# Altium schematic sheet SimPL_IMU_v1_1 _NOV23.SchDoc
size 299 x 236 mm
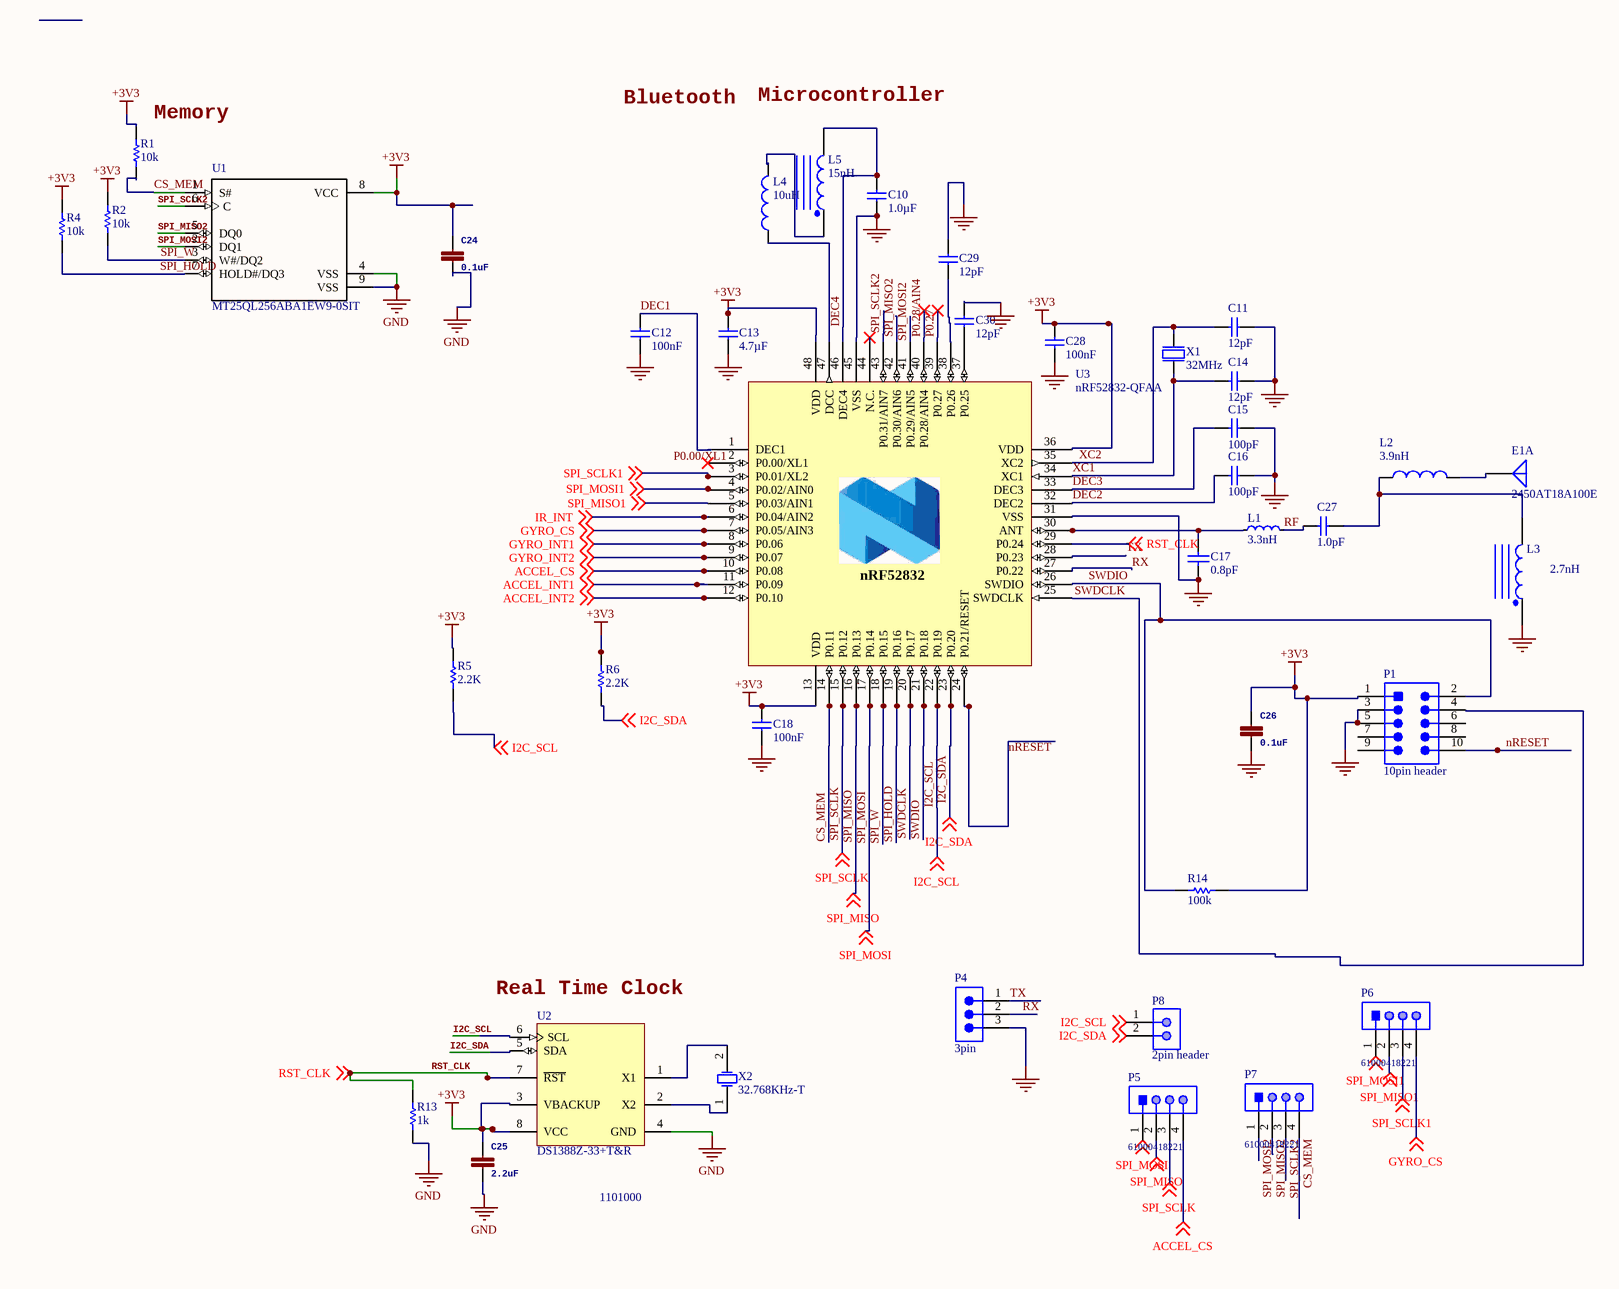
[diagram p0: SimPL_IMU_v1_1 _NOV23.SchDoc]

## Parts
C10  1.0µF  [CAPC1005X04L]
C11  12pF  [CAPC0603X03L]
C12  100nF  [CAPC0603X03L]
C13  4.7µF  [CAPC1608X06L]
C14  12pF  [CAPC0603X03L]
C15  100pF  [CAPC0603X03L]
C16  100pF  [CAPC0603X03L]
C17  0.8pF  [CAPC1006X50X20ML10T10]
C18  100nF  [CAPC0603X03L]
C24  0.1uF  [0402]
C25  2.2uF  [0402]
C26  0.1uF  [0402]
C27  1.0pF  [CAPC0603X03L]
C28  100nF  [CAPC0603X03L]
C29  12pF  [CAPC0603X03L]
C30  12pF  [CAPC0603X03L]
E1  2450AT18A100E  [JT-2450AT18A100-2_V]  (part A of 2)
L1  3.3nH  [INDC0603X03L]
L2  3.9nH  [*INDC1006X60N]
L3  2.7nH  [INDC1005X55X25LL05T10_A]
L4  10uH  [MURA-IND0805_L]
L5  15nH  [INDC1005X55X25ML05T10_A]
P1  10pin header  [SMTC-FTSH-105-01-L-DV_V]
P4  3pin  [SMTC-TSW-103-07-X-S]
P5  61000418221  [61000418221]
P6  61000418221  [61000418221]
P7  61000418221  [61000418221]
P8  2pin header  [AMPH-68000-102HLF_V]
R1  10k  [RESC1005X40X25NL05T05]
R2  10k  [RESC1005X40X25NL05T05]
R4  10k  [RESC1005X40X25NL05T05]
R5  2.2K  [RESC1005X40X25ML10T10]
R6  2.2K  [RESC1005X40X25ML10T10]
R13  1k  [RESC1005X40X25NL05T05]
R14  100k  [RESC1005X40X25ML05T05]
U1  MT25QL256ABA1EW9-0SIT  [*SON127P600X800X80-9N]
U2  DS1388Z-33+T&R  [S8+4_M]
U3  nRF52832-QFAA  [QFN40P600X600X90-48N]
X1  32MHz  [BT-XTAL_2016]
X2  32.768KHz-T  [ABRA-ABS07-2_V]

## Nets
+3V3: C13.1 C18.1 C24.1 C25.1 C26.1 C28.1 P1.1 R1.2 R2.2 R4.2 R5.2 R6.2 R14.2 U1.8(VCC) U2.3(VBACKUP) U2.8(VCC) U3.13(VDD) U3.36(VDD) U3.48(VDD)
GND: C10.1 C11.1 C12.2 C13.2 C14.1 C15.2 C16.1 C17.1 C18.2 C24.2 C25.2 C26.2 C28.2 C29.1 C30.1 L3.1 P1.3 P1.5 P4.3 R13.1 U1.4(VSS) U1.9(VSS) U2.4(GND) U3.31(VSS) U3.45(VSS) U3.49(GND) X1.2(GND) X1.4(GND)
ACCEL_CS: P5.4 U3.10(P0.08) ; off-sheet ACCEL_CS
ACCEL_INT1: U3.11(P0.09) ; off-sheet ACCEL_INT1
ACCEL_INT2: U3.12(P0.10) ; off-sheet ACCEL_INT2
CS_MEM: P7.4 R1.1 U1.1(S#) U3.14(P0.11)
DEC1: C12.1 U3.1(DEC1)
DEC2: C16.2 U3.32(DEC2)
DEC3: C15.1 U3.33(DEC3)
DEC4: C10.2 L5.2 U3.46(DEC4)
GYRO_CS: P6.4 U3.7(P0.05/AIN3) ; off-sheet GYRO_CS
GYRO_INT1: U3.8(P0.06) ; off-sheet GYRO_INT1
GYRO_INT2: U3.9(P0.07) ; off-sheet GYRO_INT2
I2C_SCL: P8.1 R5.1 U2.6(SCL) U3.22(P0.19) ; off-sheet I2C_SCL
I2C_SDA: P8.2 R6.1 U2.5(SDA) U3.23(P0.20) ; off-sheet I2C_SDA
IR_INT: U3.6(P0.04/AIN2) ; off-sheet IR_INT
nRESET: P1.10 U3.24(P0.21/RESET)
P0.27: U3.39(P0.27)
P0.28/AIN4: U3.40(P0.28/AIN4)
RF: C27.2 L1.2
RST_CLK: R13.2 U2.7(~{RST}) U3.29(P0.24) ; off-sheet RST_CLK
RX: P4.2 U3.27(P0.22)
SPI_HOLD: R4.1 U1.7(HOLD#/DQ3) U3.19(P0.16)
SPI_MISO: P5.2 U3.16(P0.13) ; off-sheet SPI_MISO
SPI_MISO1: P6.2 U3.5(P0.03/AIN1) ; off-sheet SPI_MISO1
SPI_MISO2: P7.2 U1.5(DQ0) U3.42(P0.30/AIN6)
SPI_MOSI: P5.1 U3.17(P0.14) ; off-sheet SPI_MOSI
SPI_MOSI1: P6.1 U3.4(P0.02/AIN0) ; off-sheet SPI_MOSI1
SPI_MOSI2: P7.1 U1.2(DQ1) U3.41(P0.29/AIN5)
SPI_SCLK: P5.3 U3.15(P0.12) ; off-sheet SPI_SCLK
SPI_SCLK1: P6.3 U3.3(P0.01/XL2) ; off-sheet SPI_SCLK1
SPI_SCLK2: P7.3 U1.6(C) U3.43(P0.31/AIN7)
SPI_W: R2.1 U1.3(W#/DQ2) U3.18(P0.15)
SWDCLK: P1.4 U3.20(P0.17) U3.25(SWDCLK)
SWDIO: P1.2 R14.1 U3.21(P0.18) U3.26(SWDIO)
TX: P4.1 U3.28(P0.23)
XC1: C14.2 U3.34(XC1) X1.1(inp)
XC2: C11.2 U3.35(XC2) X1.3(out)
NetC17_2: C17.2 L1.1 U3.30(ANT)
NetC27_1: C27.1 L2.1 L3.2
NetC29_2: C29.2 U3.38(P0.26)
NetC30_2: C30.2 U3.37(P0.25)
NetE1_1: E1.1(FP) L2.2
NetL4_1: L4.1 U3.47(DCC)
NetL4_2: L4.2 L5.1
NetU2_1: U2.1(X1) X2.2(X2)
NetU2_2: U2.2(X2) X2.1(X2)

Not connected (* = marked no-connect by the designer): P1 6 7 8 9; U3 2(P0.00/XL1)* 44(N.C.)*

## Notes on the sheet
- (near R1) Memory
- Bluetooth
- Microcontroller
- (near U2) Real Time Clock
- 1101000
- Labels drawn without touching a wire or pin: P0.00/XL1
- (in symbol nRF52832_QFAA) nRF52832

## Library data of the parts
C10 = C0402-1µ0: Capacitor, X5R, ±5%; Note: 6.3V; Artikkelnr Noca: 20039235; Artikkelnr Simpro: N.A.; Part Number: C0402-1µ0; Manufacturer: *; Manufacturer Part Number: *; Datasheet: *; LatestRevisionDate: 2009-11-23; Pin Count: 2; Publisher: Nordic Semiconductor; Published: 2009-05-08; Value: 1.0µF; Supplier: *; Supplier part number: *; 2nd source Supplier: *; 2nd source part number: *; Footprint Doc: 0402
C11 C14 C29 C30 = C0201-12p: Capacitor, NP0, ±2%; Note: 50V; Artikkelnr Noca: N.A.; Part Number: C0201-12p; Manufacturer: *; Manufacturer Part Number: *; Datasheet: *; LatestRevisionDate: 2014-11-13; Pin Count: 2; Publisher: Nordic Semiconductor; Published: 2014-11-13; Value: 12pF; Supplier: *; Supplier part number: *; 2nd source Supplier: *; 2nd source part number: *; Footprint Doc: 0201; Artikkelnr Simpro: N.A.
C12 C18 C28 = C0201-100n: Capacitor, X7R, ±10%; Note: 16V; Artikkelnr Noca: N.A.; Part Number: C0201-100n; Manufacturer: *; Manufacturer Part Number: *; Datasheet: *; LatestRevisionDate: 2014-11-13; Pin Count: 2; Publisher: Nordic Semiconductor; Published: 2014-11-13; Value: 100nF; Supplier: *; Supplier part number: *; 2nd source Supplier: *; 2nd source part number: *; Footprint Doc: 0201; Artikkelnr Simpro: N.A.
C13 = C0603-4µ7: Capacitor, X5R, ±10%; Note: 6.3V; Artikkelnr Noca: 20069060; Artikkelnr Simpro: N.A.; Part Number: C0603-4µ7; Manufacturer: *; Manufacturer Part Number: *; Datasheet: *; LatestRevisionDate: 2009-11-23; Pin Count: 2; Publisher: Nordic Semiconductor; Published: 2009-05-08; Value: 4.7µF; Supplier: *; Supplier part number: *; 2nd source Supplier: *; 2nd source part number: *; Footprint Doc: 0603
C15 C16 = C0201-100p: Capacitor, NP0, ±5%; Note: Chip Cap 1%; Artikkelnr Noca: N.A.; Part Number: C0201-100p; Manufacturer: *; Manufacturer Part Number: *; Datasheet: *; LatestRevisionDate: 2014-11-13; Pin Count: 2; Publisher: Nordic Semiconductor; Published: 2014-11-13; Value: 100pF; Supplier: *; Supplier part number: *; 2nd source Supplier: *; 2nd source part number: *; Footprint Doc: 0201; Artikkelnr Simpro: N.A.
C17 = CMP-2008-04732-1: Part Number: 04023J0R8PBSTR; Manufacturer: AVX Interconnect / Elco
C24 C26 = 0.1UF-0402-16V-10%: 0.1ÂµF ceramic capacitors    A capacitor is a passive two-terminal electrical component used to store electrical energy temporarily in an electric field.; GateName_1: G$1; SymbolName_1: CAP; PROD_ID: CAP-12416; DeviceName: -0402-16V-10%; LibraryName: SparkFun-Capacitors; DeviceSetName: 0.1UF
C25 = 0.1UF-0402-16V-10%: 0.1ÂµF ceramic capacitors    A capacitor is a passive two-terminal electrical component used to store electrical energy temporarily in an electric field.; GateName_1: G$1; SymbolName_1: CAP; DeviceSetName: 0.1UF; PROD_ID: CAP-12416; DeviceName: -0402-16V-10%; LibraryName: SparkFun-Capacitors
C27 = C0201-1.0p: Capacitor, NP0, ±5%; Note: Chip Cap 1%; Artikkelnr Noca: N.A.; Part Number: C0201-1.0p; Manufacturer: *; Manufacturer Part Number: *; Datasheet: *; LatestRevisionDate: 2014-11-13; Pin Count: 2; Publisher: Nordic Semiconductor; Published: 2014-11-13; Value: 1.0pF; Supplier: *; Supplier part number: *; 2nd source Supplier: *; 2nd source part number: *; Footprint Doc: 0201; Artikkelnr Simpro: N.A.
E1 = CMP-2000-05167-1: Ceramic Antenna, 2.45 GHZ, 2 W, -40 to 125 degC, 2-Pin SMD, RoHS, Tape and Reel; Manufacturer: Johanson Technology; Maximum Frequency: 2500MHz; Typical Antenna Gain: 0.5dB; Minimum Frequency: 2400MHz; Manufacturer URL: https://www.johansontechnology.com/; Type: Ceramic; Datasheet Version: Rev. 1.3, 07/2014; Category: Antenna; Package: 2Case18-4; Datasheet URL: http://www.johansontechnology.com/datasheets/antennas/2450AT18A100.pdf
L1 = L0201-3n3: High frequency chip inductor ±5%; Artikkelnr Noca: N.A.; Part Number: L0201-3n3; Manufacturer: *; Manufacturer Part Number: *; Datasheet: *; LatestRevisionDate: 2013-04-10; Pin Count: 2; Publisher: Nordic Semiconductor; Published: 2013-04-10; Value: 3.3nH; Note: High frequency chip inductor ±5%; Supplier: *; Supplier part number: *; 2nd source Supplier: *; 2nd source part number: *; Footprint Doc: 0201; Artikkelnr Simpro: N.A.
L2 = MHQ1005P3N9CT000: Inductor, 3.9nh, 0.2nh, 0.9a, 0402; MF: TDK; SnapEDA_Link: https://www.snapeda.com/parts/MHQ1005P3N9CT000/TDK/view-part/?ref=snap; MP: MHQ1005P3N9CT000; Availability: Unavailable; Package: 1006 TDK; Price: None; Value: *
L3 = CMP-2000-06580-1: Chip Inductor, 2.7 nH, +/- 0.3 nH, 300 mA, -55 to 125 degC, 0402 (1005 Metric), RoHS, Tape and Reel; Manufacturer: Murata; Type: Multilayer; Frequency - Self Resonant: 6GHz; Shielding: Unshielded; Online Catalog: LQG15HxSeries; Other Names: 490-2615-2; Catalog Drawings: LQG15HSSeriesTopLQG15HSSeriesEnd; Q @ Freq: 8@100MHz; DC Resistance (DCR): 150mOhmMax; Frequency - Test: 100MHz; Product Training Modules: InductorProducts; Current Rating: 300mA; Material - Core: Air; Tolerance: ±0.3nH; Package Description: 2-Pin Surface Mount Device, Body 1 x 0.5 mm; Inductance: 2.7nH; Mounting Technology: SurfaceMount; Height - Seated (Max): 0.022"(0.55mm); Category: Inductors,Coils,Chokes; Package / Case: 0402(1005Metric); Package Reference: 0402; Standard Package: 10,000; Operating Temperature: -55°C~125°C; Mounting Type: SurfaceMount; Packaging: Tape&Reel(TR); Series: LQG15HS; Datasheet URL: http://search.murata.co.jp/Ceramy/image/img/PDF/ENG/L0075S0083LQG15HS.pdf; Manufacturer URL: http://www.murata.com/; Family: FixedInductors; Size / Dimension: 0.039"Lx0.020"W(1.00mmx0.50mm); Datasheet Version: 09/2010
L4 = CMP-2000-06587-1: Fixed Inductor, 10 uH, +/-20%, -55 to 125 degC, 2-Pin SMD (0805), RoHS, Tape and Reel; Manufacturer: Murata; Tolerance (%): 20%; DC Resistance: 0.6; Inductance-Nom: 10H; Rated Current-Max: 100mA; Package Reference: IND0805; Case Size/Dimension: 0805; Manufacturer URL: http://www.murata.com/; Package Description: 2-Pin Surface Mount Device, Body 2 x 1.25 mm; Datasheet URL: http://psearch.en.murata.com/inductor/product/LQM21FN100M70%23.pdf; Mounting Technology: SurfaceMount; Datasheet Version: 05/2016
L5 = CMP-2100-03652-1: Chip Inductor, 15 nH, +/- 5%, 100 MHz, -55 to 125 degC, 0402 (1005 Metric), RoHS, Paper Tape; Manufacturer: Murata; DC Current: 300mA; Q Factor: 8; Self Resonant Frequency: 2.5GHz; DC Resistance (DCR): 320mOhm; Test Frequency: 100MHz; Shielding: Unshielded; Core Material: Air; Lead Free: LeadFree; Package Quantity: 10000; Package Description: 2-Pin Surface Mount Device, Body 1 x 0.5 mm; Case Code (Imperial): 0402; Termination: SMD/SMT; Datasheet URL: http://psearch.en.murata.com/inductor/product/LQG15HS15NJ02_.pdf; Case Code (Metric): 1005; Tolerance: 5%; Min Operating Temperature: -55degC; Radiation Hardening: No; Width: 0.02inch; Current Rating: 300mA; Packaging: TapeandReel; Height: 0.5mm; Manufacturer URL: http://www.murata.com/; Case/Package: 0402; Max DC Current: 300mA; Height - Seated (Max): 0.022inch; Package Reference: 0402; Length: 1mm; Max Operating Temperature: 125degC; Military Standard: Not; Datasheet Version: 42675.0; Depth: 0.55mm; Inductance: 15nh; RoHSCompliant: true
P1 = CMP-2000-05354-1: Male Header, Pitch 1.27 mm, 2 x 5 Position, Height 5.96 mm, -55 to 125 degC, RoHS, Bulk; Manufacturer: Samtec; Connector Type: Header,Unshrouded; Pitch: 0.050"(1.27mm); Mating Products: FLE-105-01-G-DV-TR-ND-CONNSKT1.27MM10POSDUALSMDCLP-105-02-G-D-P-TR-ND-CONNRCPT10POSDUAL.05"SMDSFMC-105-L2-S-D-TR-ND-CONN.05"SURFACE10POSSMTSFMH-105-02-L-D-TR-ND-CONNRECEPT10POS.50"SMTFLE-105-01-G-DV-A-ND-CONNSKT1.27MM10POSDUALSMDCLP-105-02-G-D-BE-ND-CONNRCPT10POSDUAL.05"SMDFLE-105-01-G-DV-A-P-ND-CONNSKT1.27MM10POSDUALSMDSAM1153-05-ND-CONNRCPT10POSDUAL.05"SMDSAM1155-05-ND-CONNRCPT10POSDUAL.05"SMDSAM1154-05-ND-CONNRCPT10POSDUAL.05"SMDSFMH-105-02-L-D-LC-ND-CONNRECEPT10POS.50"SMTSAM1226-05-ND-CONNRCPT.05"10POSDUALSMD; Catalog Drawings: FTSHSeriesFTSHSeriesSMTSide; Other Names: SAM1161-05; EDA / CAD Models: DownloadfromAcceleratedDesigns; Number of Positions Loaded: All; Number of Positions: 10; Featured Product: Board-To-BoardInterconnectSystems; Online Catalog: FTSHSeries; Product Training Modules: Board-to-BoardConnectors; Category: Connectors,Interconnects; Number of Rows: 2; Contact Finish: Gold; Termination: Solder; Mounting Type: SurfaceMount; Series: FTSH; Contact Mating Length: 0.120"(3.05mm); Row Spacing: 0.050"(1.27mm); Datasheet URL: https://datasheet.ciiva.com/30493/0900766b80adfe36-30493006.pdf; Contact Finish Thickness: 10µin(0.25µm); Features: -; Standard Package: 1; Packaging: Bulk; Datasheet Version: Feb-08; Manufacturer URL: http://www.samtec.com/; Fastening Type: -; Family: RectangularConnectors-Headers,MalePins; Contact Type: MalePin; Color: Black
P4 = CMP-1024-00333-1: 0.025" SQ Post Header, Through-hole, Vertical, -55 to 125 degC, 2.54 mm Pitch, 3-Pin, Male, RoHS; Manufacturer: Samtec; PartNumber: TSW-103-07-G-S; Pitch: 2.54 mm; ComponentLink3URL: http://www.samtec.com/documents/webfiles/cpdf/TSW-XXX-XX-XXX-X-XX-XXX-MKT.pdf; Temperature Range: -55 to 125 degC; DatasheetVersion: F-214; ComponentLink1Description: Manufacturer URL; ComponentLink2URL: http://www.samtec.com/documents/webfiles/pdf/TSW_TH.PDF; RoHS: True; Orientation: Vertical; ComponentLink2Description: Datasheet; ComponentLink3Description: Package Specification; PackageDescription: .025[0.64] SQ. Post Terminal Strip Assembly; Mounting Technology: Through-hole; PackageVersion: DM, 8/1988; ComponentLink1URL: http://www.samtec.com; PackageReference: TSW-103-07-X-S
P5-P7 = CMP-1502-01019-1: SMT Vertical Pin Header WR-PHD, Pitch 2.54 mm, Single Row, 4 pins; Manufacturer: Wurth Elektronik; Rated Current: 3A; Gender: Male; Withstanding Voltage: 500VAC; Working Voltage: 250VAC; Pitch: 2.54mm; Pin Number: 4; Contact Resistance: 20mOhm; Mounting Technology: SMT; Packaging: Tube; Manufacturer URL: http://www.we-online.de; Row Number: Single; Operating Temperature: -40to125degC; Part Number: 61000418221; Publisher: WurthElektronik; Orientation: Vertical; Package Reference: 61000418221; Datasheet URL: https://katalog.we-online.de/em/datasheet/6100xx18221.pdf
P8 = CMP-2000-05666-1: Male Header, Pitch 2.54 mm, 1 x 2 Position, Height 8.38 mm, Tail Length 2.41 mm, RoHS, Bulk; Number of Positions: 2; Insulation Resistance: 5000MOhms; Voltage Rating: 1.5kV; Mounting Angle: Vertical; Pitch: 2.54mm; Brand: FCI; Current Rating: 3A; Mating Post Length: 5.84mm; Operating Temperature Range: -65Cto+125C; Product Category: Headers&WireHousings; Datasheet URL: https://datasheet.ciiva.com/5149/68000-274228-5149165.pdf; Number of Positions / Contacts: 2; Contact Gender: Pin(Male); Packaging: Bulk; Mounting Technology: ThroughHole; Product Type: Headers; Housing Material: Thermoplastic; Contact Material: PhosphorBronze; Contact Plating: Gold/GTX; Package Description: Male Header, Pitch 2.54 mm, 1 x 2 Position, Height 8.38 mm, Tail Length 2.41 mm; Package Reference: 68000-102HLF; Type: Unshrouded; Factory Pack Quantity: 100; Termination Style: ThroughHole; RoHS: Details; Series: 68000; Mounting Style: ThroughHole; Flammability Rating: UL94V-0; Number of Rows: 1; Manufacturer: FCI; Termination Post Length: 2.41mm; Manufacturer URL: http://www.amphenol.com/; Datasheet Version: Rev. F, 04/2006
R1 R2 R4 = CMP-2002-00607-3: Chip Resistor, 10 KOhm, +/- 1%, 100 mW, -55 to 155 degC, 0402 (1005 Metric), RoHS, Tape and Reel; Manufacturer: Basic Passives; PartNumber: ERJ-2RKF1002X; Case\/Package: 0402; Resistance: 10 KOhm; Voltage Rating: 50 V; Power Rating: 100 mW; Packaging: Tape and Reel; Width: 0.5 mm; Package Quantity: 10000; Radiation Hardening: No; Min Operating Temperature: -55 degC; Case Code (Imperial): 0402; REACH SVHC: Yes; PackageDescription: 2-Pin Surface Mount Device, Body 1 x 0.5 mm; Length: 1 mm; ComponentLink1Description: Manufacturer URL; PackageReference: 0402; RoHSCompliant: true; ComponentLink1URL: http://www.panasonic.com/; Height: 0.35 mm; ComponentLink2Description: Datasheet; DatasheetVersion: 04/2015; Mounting Technology: Surface Mount; ComponentLink2URL: http://industrial.panasonic.com/cdbs/www-data/pdf/RDA0000/AOA0000C86.pdf; Max Operating Temperature: 155 degC; Pins: 2; Tolerance: 1%; Case Code (Metric): 1005; Mount: Surface Mount
R5 R6 = CMP-2002-06097-1: Part Number: MC00625W040212K2; Manufacturer: Multicomp
R13 = CMP-2002-08276-1: Manufacturer: Vishay Dale; Part Number: CRCW04021K00FKED
R14 = CMP-2002-08123-2: Chip Resistor, 100 KOhm, +/- 1%, 0.63 W, -55 to 155 degC, 0402 (1005 Metric), RoHS, Tape and Reel; Voltage Rating: 50 V; Type (Resistor): Thick Film; Power Rating: 63 mW; Case\Package: 0402; Mount: Surface Mount; Packaging: Tape and Reel; Weight: 2.3E-05 oz; PackageDescription: 2-Pin Surface Mount Device, Body 1 x 0.5 mm; ComponentLink1Description: Manufacturer URL; ComponentLink2Description: Datasheet; Min Operating Temperature: -55 degC; Width: 0.5 mm; Resistance: 100 kohm; REACH SVHC: Unknown; ComponentLink2URL: http://www.vishay.com/docs/20035/dcrcwe3.pdf; Package Quantity: 10000; Mounting Technology: Surface Mount; PackageReference: 0402; ComponentLink1URL: http://www.vishay.com/; Max Operating Temperature: 155 degC; Length: 1 mm; DatasheetVersion: 06/2012; Height: 0.35 mm; Case Code (Imperial): 0402; Pins: 2; Tolerance: 1%; Case Code (Metric): 1005; Radiation Hardening: No; RoHSCompliant: true
U1 = MT25QL256ABA1EW9-0SIT: NOR Flash Serial-SPI 3.3V 256Mbit 256M x 1bit 8-Pin WPDFN; MF: Micron Technology; SnapEDA_Link: https://www.snapeda.com/parts/MT25QL256ABA1EW9-0SIT/Micron%20Technology%20Inc./view-part/?ref=snap; Availability: Unavailable; Price: None; MP: MT25QL256ABA1EW9-0SIT; Package: WDFN-8 Micron Technology; Value: *
U2 = CMP-0254-00385-1: I2C Real-Time Clock/Supervisor with Trickle Charger and 512 Byte EEPROM, 3.3V, 8-Pin SO, -40 to 85 degC, Pb-Free, Reel; Code_IPC: SOIC127P600-8; ComponentLink3URL: http://pdfserv.maxim-ic.com/package_dwgs/21-0041.PDF; ComponentLink1URL: http://www.maxim-ic.com; ComponentLink2Description: Datasheet; PackageVersion: revC, 2010; ComponentLink1Description: Manufacturer URL; DatasheetVersion: rev3, Aug-2010; PackageReference: S8+4; ComponentLink2URL: http://datasheets.maxim-ic.com/en/ds/DS1388.pdf; PackageDescription: 8-Pin Small-Outline IC, Narrow (0.15in), 1.27 mm Pitch, SOIC (N), Pb-Free; Code_JEDEC: MS-012-AA; ComponentLink3Description: Package Specification
U3 = nRF52832_QFAA: Multi-protocol Bluetooth Low Energy, ANT and 2.4GHz proprietary system-on-chip; Manufacturer: Nordic Semiconductor; Artikkelnr Noca: N.A.; Part Number: nRF52832-QFAA; Manufacturer Part Number: nRF52832-QFAA; Datasheet: *; LatestRevisionDate: 2014-11-26; Pin Count: 48; Publisher: Nordic Semiconductor; Published: 2014-11-26; Value: nRF52832-QFAA; Note: *; Supplier: Nordic Semiconductor; Supplier part number: *; 2nd source Supplier: *; 2nd source part number: *; Footprint Doc: QFN-48; Artikkelnr Simpro: N.A.
X1 = XTAL_SMD2016_32MHz_8pF_Epson: XTAL SMD 2016, 32MHz, Cl=8pF, Total Tol: ±40ppm; Manufacturer: Epson Toyocom; Manufacturer Part Number: Q22FA12800025; Note: XTAL SMD 32.000MHz; Artikkelnr Noca: N.A.; Part Number: XTAL_SMD2016_32MHz_8pF_Epson; Datasheet: http://www.epsondevice.com/docs/qd/en/DownloadServlet?id=ID000449; LatestRevisionDate: 2014-11-27; Pin Count: 4; Publisher: Nordic Semiconductor; Published: 2012-03-09; Value: 32MHz; Supplier: Farnell; Supplier part number: 171-2806; 2nd source Supplier: *; 2nd source part number: *; Footprint Doc: XTAL_2016; Artikkelnr Simpro: N.A.
X2 = CMP-0447-00001-2: Crystal, 32.768 kHz, 12.5 pF, -40 to 85 degC, SMD Low Profile 3.2 x 1.5 x 0.9 mm, Tape and Reel; Manufacturer: Abracon; PartNumber: ABS07-32.768KHz-T; Q Value (Type): 30000; Operation Mode: Flexural Mode (Tuning Fork); Shunt Capacitance (C0): 0.9 to 1.2 pF; Load Capacitance (CL): 12.5 pF; Frequency Tolerance @+25degC: +/- 20 ppm; Drive Level (Type): 0.1 uW; Equivalent Series Resistance (R1): 70 Kohm; Insulation Resistance (Min): 500 Mohm; ComponentLink3URL: http://www.abracon.com/Resonators/ABS07.pdf; PackageDescription: 2-Pin Hand Drawn, Body 3.2x1.5mm, Pitch 2.5mm; Operating Temperature: -40 to 85 degC; ComponentLink2URL: http://www.abracon.com/Resonators/ABS07.pdf; PackageReference: ABS07-2; ComponentLink3Description: Package Specification; ComponentLink1Description: Manufacturer URL; DatasheetVersion: 04.03.13; Mounting Technology: Surface Mount; ComponentLink2Description: Datasheet; ComponentLink1URL: http://www.abracon.com/; Packing: Tape and Reel; Frequency: 32.768 kHz